# Altium schematic sheet [5]-USB2, TYPEC, USIC.SchDoc: RK3399 SOM Board Design V1.0
size A4; Author: AVIRAL MISHRA; DocumentNumber: 7; SheetNumber: 7; SheetTotal: 21; PROJECT CODE: A_V1.0
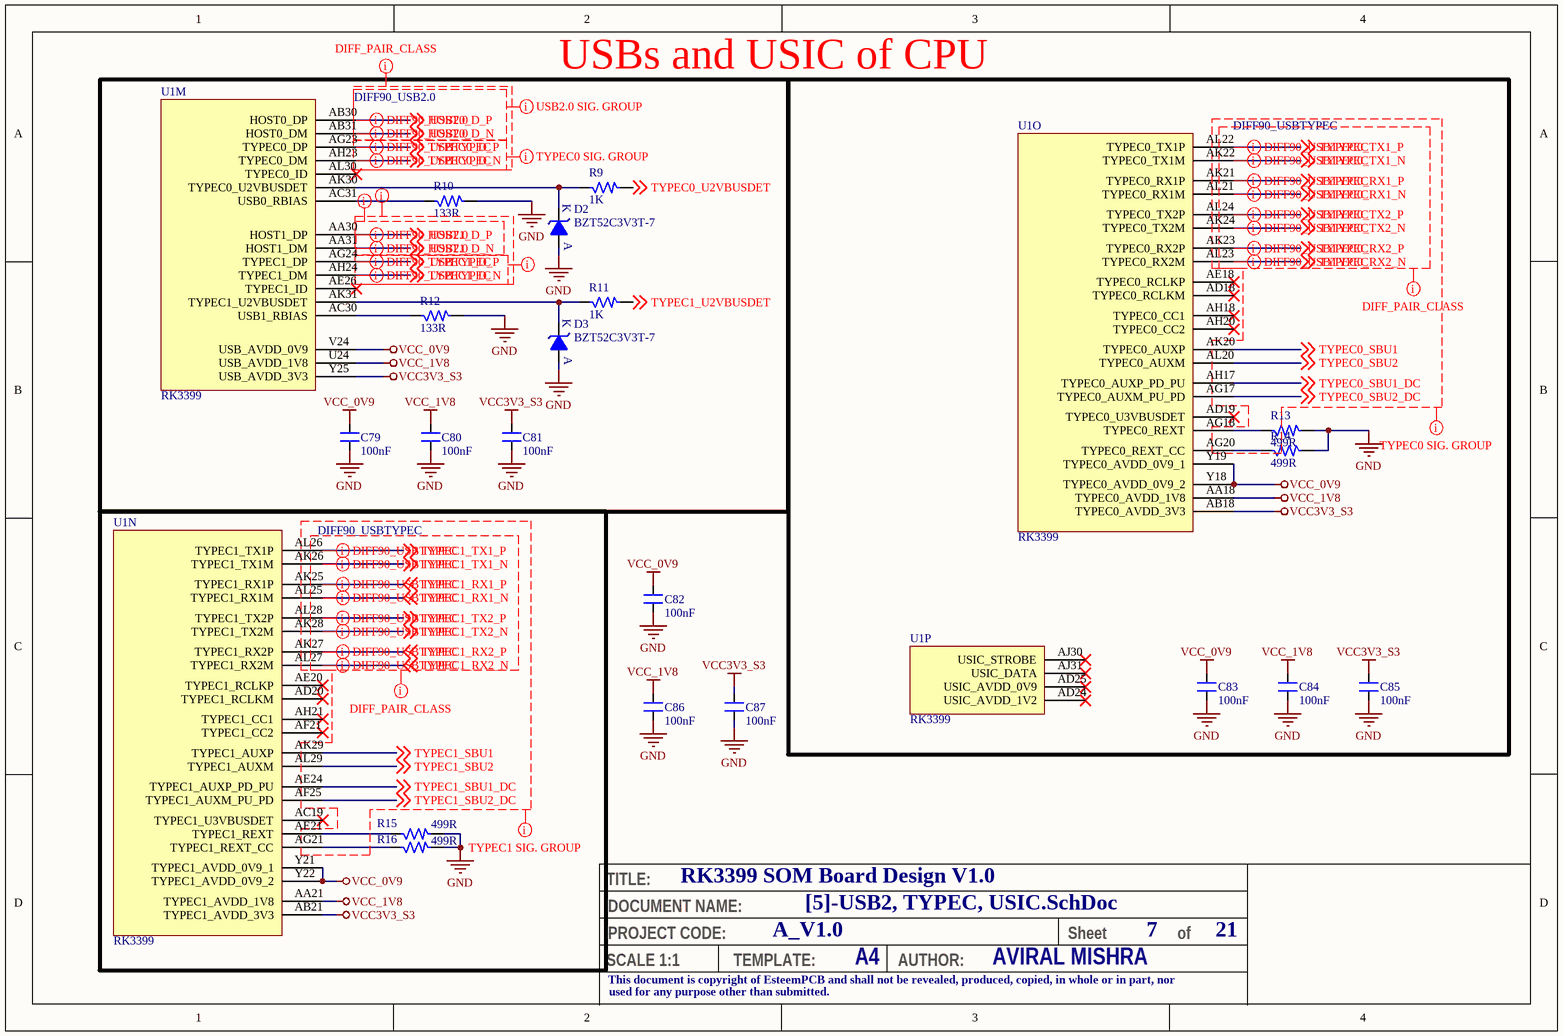
[diagram p0: [5]-USB2, TYPEC, USIC.SchDoc]

## Parts
C79  100nF  [CAP_0201]
C80  100nF  [CAP_0201]
C81  100nF  [CAP_0201]
C82  100nF  [CAP_0201]
C83  100nF  [CAP_0201]
C84  100nF  [CAP_0201]
C85  100nF  [CAP_0201]
C86  100nF  [CAP_0201]
C87  100nF  [CAP_0201]
D2  BZT52C3V3T-7  [DIO_SOD523]
D3  BZT52C3V3T-7  [DIO_SOD523]
R9  1K  [RES_0201]
R10  133R  [RES_0201]
R11  1K  [RES_0201]
R12  133R  [RES_0201]
R13  499R  [RES_0201]
R14  499R  [RES_0201]
R15  499R  [RES_0201]
R16  499R  [RES_0201]
U1  RK3399  [FBGA828_23_826X826]  (parts M,N,O,P of 24)

## Blocks framed on the sheet
USBs and USIC of CPU: C79-C81 D2 D3 R9-R12 U1

## Nets
GND: C79.2 C80.1 C81.1 C82.1 C83.1 C84.1 C85.1 C86.1 C87.1 D2.A D3.A R10.2 R12.2 R13.2 R14.2 R15.2 R16.2
VCC3V3_S3: C81.2 C85.2 C87.2 U1.AB18(TYPEC0_AVDD_3V3) U1.AB21(TYPEC1_AVDD_3V3) U1.Y25(USB_AVDD_3V3)
VCC_0V9: C79.1 C82.2 C83.2 U1.V24(USB_AVDD_0V9) U1.Y18(TYPEC0_AVDD_0V9_2) U1.Y19(TYPEC0_AVDD_0V9_1) U1.Y21(TYPEC1_AVDD_0V9_1) U1.Y22(TYPEC1_AVDD_0V9_2)
VCC_1V8: C80.2 C84.2 C86.2 U1.AA18(TYPEC0_AVDD_1V8) U1.AA21(TYPEC1_AVDD_1V8) U1.U24(USB_AVDD_1V8)
HOST0_D_N: U1.AB31(HOST0_DM) ; off-sheet HOST0_D_N
HOST0_D_P: U1.AB30(HOST0_DP) ; off-sheet HOST0_D_P
HOST1_D_N: U1.AA31(HOST1_DM) ; off-sheet HOST1_D_N
HOST1_D_P: U1.AA30(HOST1_DP) ; off-sheet HOST1_D_P
TYPEC0_D_N: U1.AH23(TYPEC0_DM) ; off-sheet TYPEC0_D_N
TYPEC0_D_P: U1.AG23(TYPEC0_DP) ; off-sheet TYPEC0_D_P
TYPEC0_RX1_N: U1.AL21(TYPEC0_RX1M) ; off-sheet TYPEC0_RX1_N
TYPEC0_RX1_P: U1.AK21(TYPEC0_RX1P) ; off-sheet TYPEC0_RX1_P
TYPEC0_RX2_N: U1.AL23(TYPEC0_RX2M) ; off-sheet TYPEC0_RX2_N
TYPEC0_RX2_P: U1.AK23(TYPEC0_RX2P) ; off-sheet TYPEC0_RX2_P
TYPEC0_SBU1: U1.AK20(TYPEC0_AUXP) ; off-sheet TYPEC0_SBU1
TYPEC0_SBU1_DC: U1.AH17(TYPEC0_AUXP_PD_PU) ; off-sheet TYPEC0_SBU1_DC
TYPEC0_SBU2: U1.AL20(TYPEC0_AUXM) ; off-sheet TYPEC0_SBU2
TYPEC0_SBU2_DC: U1.AG17(TYPEC0_AUXM_PU_PD) ; off-sheet TYPEC0_SBU2_DC
TYPEC0_TX1_N: U1.AK22(TYPEC0_TX1M) ; off-sheet TYPEC0_TX1_N
TYPEC0_TX1_P: U1.AL22(TYPEC0_TX1P) ; off-sheet TYPEC0_TX1_P
TYPEC0_TX2_N: U1.AK24(TYPEC0_TX2M) ; off-sheet TYPEC0_TX2_N
TYPEC0_TX2_P: U1.AL24(TYPEC0_TX2P) ; off-sheet TYPEC0_TX2_P
TYPEC0_U2VBUSDET: R9.2 ; off-sheet TYPEC0_U2VBUSDET
TYPEC1_D_N: U1.AH24(TYPEC1_DM) ; off-sheet TYPEC1_D_N
TYPEC1_D_P: U1.AG24(TYPEC1_DP) ; off-sheet TYPEC1_D_P
TYPEC1_RX1_N: U1.AL25(TYPEC1_RX1M) ; off-sheet TYPEC1_RX1_N
TYPEC1_RX1_P: U1.AK25(TYPEC1_RX1P) ; off-sheet TYPEC1_RX1_P
TYPEC1_RX2_N: U1.AL27(TYPEC1_RX2M) ; off-sheet TYPEC1_RX2_N
TYPEC1_RX2_P: U1.AK27(TYPEC1_RX2P) ; off-sheet TYPEC1_RX2_P
TYPEC1_SBU1: U1.AK29(TYPEC1_AUXP) ; off-sheet TYPEC1_SBU1
TYPEC1_SBU1_DC: U1.AE24(TYPEC1_AUXP_PD_PU) ; off-sheet TYPEC1_SBU1_DC
TYPEC1_SBU2: U1.AL29(TYPEC1_AUXM) ; off-sheet TYPEC1_SBU2
TYPEC1_SBU2_DC: U1.AF25(TYPEC1_AUXM_PU_PD) ; off-sheet TYPEC1_SBU2_DC
TYPEC1_TX1_N: U1.AK26(TYPEC1_TX1M) ; off-sheet TYPEC1_TX1_N
TYPEC1_TX1_P: U1.AL26(TYPEC1_TX1P) ; off-sheet TYPEC1_TX1_P
TYPEC1_TX2_N: U1.AK28(TYPEC1_TX2M) ; off-sheet TYPEC1_TX2_N
TYPEC1_TX2_P: U1.AL28(TYPEC1_TX2P) ; off-sheet TYPEC1_TX2_P
TYPEC1_U2VBUSDET: R11.2 ; off-sheet TYPEC1_U2VBUSDET
NetD2_K: D2.K R9.1 U1.AK30(TYPEC0_U2VBUSDET)
NetD3_K: D3.K R11.1 U1.AK31(TYPEC1_U2VBUSDET)
NetR10_1: R10.1 U1.AC31(USB0_RBIAS)
NetR12_1: R12.1 U1.AC30(USB1_RBIAS)
NetR13_1: R13.1 U1.AG18(TYPEC0_REXT)
NetR14_1: R14.1 U1.AG20(TYPEC0_REXT_CC)
NetR15_1: R15.1 U1.AE21(TYPEC1_REXT)
NetR16_1: R16.1 U1.AG21(TYPEC1_REXT_CC)

Not connected (* = marked no-connect by the designer): U1 AC19(TYPEC1_U3VBUSDET)* AD18(TYPEC0_RCLKM)* AD19(TYPEC0_U3VBUSDET)* AD20(TYPEC1_RCLKM)* AD24(USIC_AVDD_1V2)* AD25(USIC_AVDD_0V9)* AE18(TYPEC0_RCLKP)* AE20(TYPEC1_RCLKP)* AE26(TYPEC1_ID)* AF21(TYPEC1_CC2)* AH18(TYPEC0_CC1)* AH20(TYPEC0_CC2)* AH21(TYPEC1_CC1)* AJ30(USIC_STROBE)* AJ31(USIC_DATA)* AL30(TYPEC0_ID)*

## Layout directives
differential pair; differential pair class DIFF90_USB2.0: HOST0_D_N, HOST0_D_P, HOST1_D_N, HOST1_D_P
net class USB2.0 SIG. GROUP: HOST0_D_N, HOST0_D_P, HOST1_D_N, HOST1_D_P
differential pair; differential pair class DIFF90_USBTYPEC: TYPEC0_D_N, TYPEC0_D_P, TYPEC0_RX1_N, TYPEC0_RX1_P, TYPEC0_RX2_N, TYPEC0_RX2_P, TYPEC0_TX1_N, TYPEC0_TX1_P, TYPEC0_TX2_N, TYPEC0_TX2_P, TYPEC1_D_N, TYPEC1_D_P, TYPEC1_RX1_N, TYPEC1_RX1_P, TYPEC1_RX2_N, TYPEC1_RX2_P, TYPEC1_TX1_N, TYPEC1_TX1_P, TYPEC1_TX2_N, TYPEC1_TX2_P
net class TYPEC1 SIG. GROUP: TYPEC1_D_N, TYPEC1_D_P, TYPEC1_RX1_N, TYPEC1_RX1_P, TYPEC1_RX2_N, TYPEC1_RX2_P, TYPEC1_SBU1, TYPEC1_SBU1_DC, TYPEC1_SBU2, TYPEC1_SBU2_DC, TYPEC1_TX1_N, TYPEC1_TX1_P, TYPEC1_TX2_N, TYPEC1_TX2_P
net class TYPEC0 SIG. GROUP: TYPEC0_D_N, TYPEC0_D_P, TYPEC0_RX1_N, TYPEC0_RX1_P, TYPEC0_RX2_N, TYPEC0_RX2_P, TYPEC0_SBU1, TYPEC0_SBU1_DC, TYPEC0_SBU2, TYPEC0_SBU2_DC, TYPEC0_TX1_N, TYPEC0_TX1_P, TYPEC0_TX2_N, TYPEC0_TX2_P
net class DIFF_PAIR_CLASS: HOST0_D_N, HOST0_D_P, HOST1_D_N, HOST1_D_P, TYPEC0_D_N, TYPEC0_D_P, TYPEC0_RX1_N, TYPEC0_RX1_P, TYPEC0_RX2_N, TYPEC0_RX2_P, TYPEC0_TX1_N, TYPEC0_TX1_P, TYPEC0_TX2_N, TYPEC0_TX2_P, TYPEC1_D_N, TYPEC1_D_P, TYPEC1_RX1_N, TYPEC1_RX1_P, TYPEC1_RX2_N, TYPEC1_RX2_P, TYPEC1_TX1_N, TYPEC1_TX1_P, TYPEC1_TX2_N, TYPEC1_TX2_P

## Notes on the sheet
- TITLE:
- DOCUMENT NAME:
- SCALE 1:1
- This document is copyright of EsteemPCB and shall not be revealed, produced, copied, in whole or in part, nor
- PROJECT CODE:
- TEMPLATE:
- A4
- AUTHOR:
- Sheet
- of
- used for any purpose other than submitted.

## Library data of the parts
C79-C87 = CAP_100nF-25V-10%-0201: 0.1µF ±10% 25V Ceramic Capacitor X5R 0201 (0603 Metric) /; Manufacturer: TDK Corporation; Manufacturer Part Number: C0603X5R1E104K030BB; Case/Package: 0201; Supplier-1: Digikey
D2 D3 = DIO-Z_3.3V-300mW-SOD-523: Zener Diode 3.3V 300mW ±6% Surface Mount SOD-523 /; Manufacturer: Diodes Incorporated; Manufacturer Part Number: BZT52C3V3T-7; Case/Package: SOD523; Supplier-1: Digikey
R9 R11 = RES_1K-0.05W-1%-0201: 1 kOhms ±1% 0.05W, 1/20W Chip Resistor 0201 (0603 Metric) Thick Film /; Manufacturer: Yageo; Manufacturer Part Number: RC0201FR-071KL; Case/Package: 0201; Supplier-1: Digikey
R10 R12 = RES_133R-0.05W-1%-0201: 133 Ohms ±1% 0.05W, 1/20W Chip Resistor 0201 (0603 Metric) Automotive AEC-Q200 Thick Film /; Manufacturer: Panasonic Electronic Components; Manufacturer Part Number: ERJ-1GNF1330C; Case/Package: 0201; Supplier-1: Digikey
R13-R16 = RES_499R-0.05W-1%-0201: 499 Ohms ±1% 0.05W, 1/20W Chip Resistor 0201 (0603 Metric) Thick Film /; Manufacturer: Stackpole Electronics Inc; Manufacturer Part Number: RMCF0201FT499R; Case/Package: 0201; Supplier-1: Digikey
U1 = IC_RK3399-FCBGA828: RK3399 is a low power, high performance processor for computing, personal mobile.; Manufacturer: Rockchip; Manufacturer Part Number: RK3399; Case/Package: FCBGA828; Supplier-1: Rockchip